# Altium schematic sheet NAVCPeripherals.SchDoc
size 297 x 209 mm
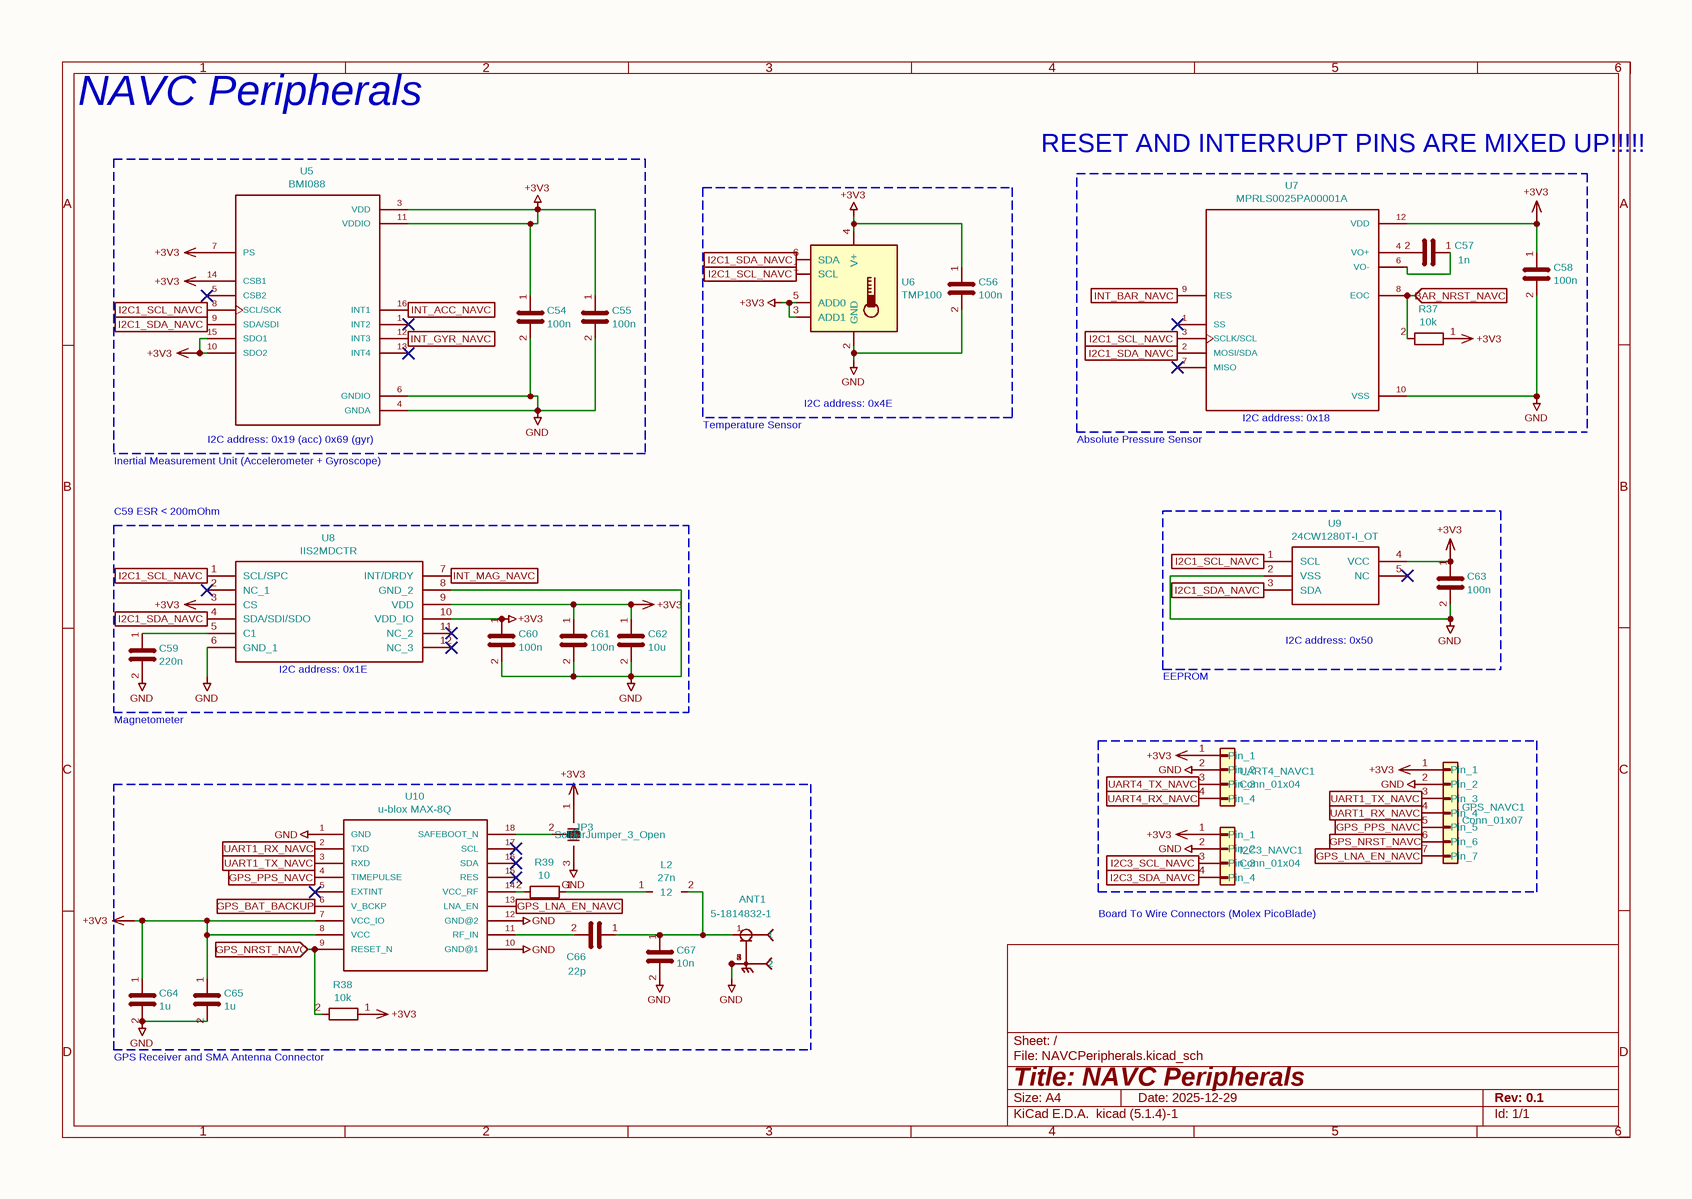
[diagram p0: NAVCPeripherals.SchDoc]

## Parts
ANT1  5-1814832-1  [TE_5-1814832-1]
C54  100n  [C_0402_1005Metric]
C55  100n  [C_0402_1005Metric]
C56  100n  [C_0402_1005Metric]
C57  1n  [C_0402_1005Metric]
C58  100n  [C_0402_1005Metric]
C59  220n  [C_0603_1608Metric]
C60  100n  [C_0402_1005Metric]
C61  100n  [C_0402_1005Metric]
C62  10u  [C_0603_1608Metric]
C63  100n  [C_0402_1005Metric]
C64  1u  [C_0603_1608Metric]
C65  1u  [C_0603_1608Metric]
C66  22p  [C_0402_1005Metric]
C67  10n  [C_0402_1005Metric]
GPS_NAVC1  Conn_01x07  [Molex_PicoBlade_53048-0710_1x07_P1.25mm_Horizontal]
I2C3_NAVC1  Conn_01x04  [Molex_PicoBlade_53048-0410_1x04_P1.25mm_Horizontal]
JP3  SolderJumper_3_Open  [SolderJumper-3_P1.3mm_Open_RoundedPad1.0x1.5mm]
L2  27n  [L_0402_1005Metric]
R37  10k  [R_0402_1005Metric]
R38  10k  [R_0402_1005Metric]
R39  10  [R_0402_1005Metric]
U5  BMI088  [PQFN50P450X300X100-16N]
U6  TMP100  [SOT-23-6]
U7  MPRLS0025PA00001A  [XDCR_MPRLS0025PA00001A]
U8  IIS2MDCTR  [IIS2MDCTR]
U9  24CW1280T-I_OT  [SOT95P280X145-5N]
U10  u-blox MAX-8Q  [GPS18P-SMD-1.1-10X9.6MM]
UART4_NAVC1  Conn_01x04  [Molex_PicoBlade_53048-0410_1x04_P1.25mm_Horizontal]

## Blocks framed on the sheet
I2C address: 0x19 (acc) 0x69 (gyr): C54 C55 U5
I2C address: 0x4E: C56 U6
I2C address: 0x18: C57 C58 R37 U7
I2C address: 0x50: C63 U9

## Ports
BAR_NRST_NAVC (in), GPS_BAT_BACKUP (in), GPS_LNA_EN_NAVC (in), GPS_NRST_NAVC (in), GPS_PPS_NAVC (in), I2C1_SCL_NAVC (in), I2C1_SDA_NAVC (in), I2C3_SCL_NAVC (in), I2C3_SDA_NAVC (in), INT_ACC_NAVC (in), INT_BAR_NAVC (in), INT_GYR_NAVC (in), INT_MAG_NAVC (in), UART1_RX_NAVC (in), UART1_TX_NAVC (in), UART4_RX_NAVC (in), UART4_TX_NAVC (in)

## Nets
+3V3: C54.1 C55.1 C56.1 C58.1 C60.1 C61.1 C62.1 C63.1 C64.1 C65.1 GPS_NAVC1.1(Pin_1) I2C3_NAVC1.1(Pin_1) JP3.1(A) R37.1 R38.1 U5.3(VDD) U5.7(PS) U5.10(SDO2) U5.11(VDDIO) U5.14(CSB1) U5.15(SDO1) U6.3(ADD1) U6.4(V+) U6.5(ADD0) U7.12(VDD) U8.3(CS) U8.9(VDD) U8.10(VDD_IO) U9.4(VCC) U10.7(VCC_IO) U10.8(VCC) UART4_NAVC1.1(Pin_1)
GND: ANT1.2 ANT1.3(2) ANT1.4(2) ANT1.5(2) C54.2 C55.2 C56.2 C58.2 C59.2 C60.2 C61.2 C62.2 C63.2 C64.2 C65.2 C67.2 GPS_NAVC1.2(Pin_2) I2C3_NAVC1.2(Pin_2) JP3.3(B) U5.4(GNDA) U5.6(GNDIO) U6.2(GND) U7.10(VSS) U8.6(GND_1) U8.8(GND_2) U9.2(VSS) U10.1(GND) U10.10(GND@1) U10.12(GND@2) UART4_NAVC1.2(Pin_2)
BAR_NRST_NAVC: R37.2 U7.8(EOC) ; port BAR_NRST_NAVC
GPS_BAT_BACKUP: U10.6(V_BCKP) ; port GPS_BAT_BACKUP
GPS_LNA_EN_NAVC: GPS_NAVC1.7(Pin_7) U10.13(LNA_EN) ; port GPS_LNA_EN_NAVC
GPS_NRST_NAVC: GPS_NAVC1.6(Pin_6) R38.2 U10.9(RESET_N) ; port GPS_NRST_NAVC
GPS_PPS_NAVC: GPS_NAVC1.5(Pin_5) U10.4(TIMEPULSE) ; port GPS_PPS_NAVC
I2C1_SCL_NAVC: U5.8(SCL/SCK) U6.1(SCL) U7.3(SCLK/SCL) U8.1(SCL/SPC) U9.1(SCL) ; port I2C1_SCL_NAVC
I2C1_SDA_NAVC: U5.9(SDA/SDI) U6.6(SDA) U7.2(MOSI/SDA) U8.4(SDA/SDI/SDO) U9.3(SDA) ; port I2C1_SDA_NAVC
I2C3_SCL_NAVC: I2C3_NAVC1.3(Pin_3) ; port I2C3_SCL_NAVC
I2C3_SDA_NAVC: I2C3_NAVC1.4(Pin_4) ; port I2C3_SDA_NAVC
INT_ACC_NAVC: U5.16(INT1) ; port INT_ACC_NAVC
INT_BAR_NAVC: U7.9(RES) ; port INT_BAR_NAVC
INT_GYR_NAVC: U5.12(INT3) ; port INT_GYR_NAVC
INT_MAG_NAVC: U8.7(INT/DRDY) ; port INT_MAG_NAVC
UART1_RX_NAVC: GPS_NAVC1.4(Pin_4) U10.2(TXD) ; port UART1_RX_NAVC
UART1_TX_NAVC: GPS_NAVC1.3(Pin_3) U10.3(RXD) ; port UART1_TX_NAVC
UART4_RX_NAVC: UART4_NAVC1.4(Pin_4) ; port UART4_RX_NAVC
UART4_TX_NAVC: UART4_NAVC1.3(Pin_3) ; port UART4_TX_NAVC
NetANT1_1: ANT1.1 C66.1 C67.1 L2.2
NetC57_1: C57.1 U7.6(VO-)
NetC57_2: C57.2 U7.4(VO+)
NetC59_1: C59.1 U8.5(C1)
NetC66_2: C66.2 U10.11(RF_IN)
NetJP3_2: JP3.2(C) U10.18(SAFEBOOT_N)
NetL2_1: L2.1 R39.1
NetR39_2: R39.2 U10.14(VCC_RF)

Not connected (* = marked no-connect by the designer): U5 1(INT2)* 5(CSB2)* 13(INT4)*; U7 1(SS)* 7(MISO)*; U8 2(NC_1)* 11(NC_2)* 12(NC_3)*; U9 5(NC)*; U10 5(EXTINT)* 15(RES)* 16(SDA)* 17(SCL)*

## Notes on the sheet
- NAVC Peripherals
- RESET AND INTERRUPT PINS ARE MIXED UP!!!!!
- Temperature Sensor
- (near U5) Inertial Measurement Unit (Accelerometer + Gyroscope)
- (near U7) Absolute Pressure Sensor
- C59 ESR < 200mOhm
- (near U8) I2C address: 0x1E
- EEPROM
- (near C59) Magnetometer
- (near I2C3_NAVC1) Board To Wire Connectors
  (Molex PicoBlade)
- GPS Receiver and SMA Antenna Connector
- 1
- 2
- 3
- 4
- 5
- 6
- A
- B
- C
- D
- Title: NAVC Peripherals
- File: NAVCPeripherals.kicad_sch
- Sheet: /
- KiCad E.D.A.  kicad (5.1.4)-1
- Size: A4
- Date: 2025-12-29
- Rev: 0.1
- Id: 1/1

## Library data of the parts
ANT1 = 5-1814832-1_2: Field4: TE Connectivity; Field5: SMA/QMA socket 50 Ohm | TE Connectivity 518148321 _SMA/QMA socket 50 Ohm RF Connectors_.; Field6: 518148321; Field7: None; Field8: Unavailable; Field9: None; Value: 5-1814832-1; Footprint: 5-1814832-1:TE_5-1814832-1
C54-C67 = C
  C54-C56 C58 C60 C61 C63: Value: 100n; Footprint: Capacitor_SMD:C_0402_1005Metric
  C57: Value: 1n; Footprint: Capacitor_SMD:C_0402_1005Metric
  C59: Value: 220n; Footprint: Capacitor_SMD:C_0603_1608Metric
  C62: Value: 10u; Footprint: Capacitor_SMD:C_0603_1608Metric
  C64 C65: Value: 1u; Footprint: Capacitor_SMD:C_0603_1608Metric
  C66: Value: 22p; Footprint: Capacitor_SMD:C_0402_1005Metric
  C67: Value: 10n; Footprint: Capacitor_SMD:C_0402_1005Metric
JP3 = SolderJumper_3_Open-Jumper: Value: SolderJumper_3_Open; Footprint: Jumper:SolderJumper-3_P1.3mm_Open_RoundedPad1.0x1.5mm
L2 = L: Value: 27n; Footprint: Inductor_SMD:L_0402_1005Metric; Supplier 1: DigiKey; Supplier Part Number 1: LQW04AN27NJ00D-ND
R37-R39 = R: Footprint: Resistor_SMD:R_0402_1005Metric
  R37 R38: Value: 10k
  R39: Value: 10
U5 = BMI088_2: Field4: None; Field5: VFLGA-16 Bosch Sensortec; Field6: Bosch Sensortec; Field7: High-performance 6-axis inertial sensor _accelerometer + gyroscope_; Field8: Unavailable; Value: BMI088; Footprint: BMI088:PQFN50P450X300X100-16N
U7 = MPRLS0025PA00001A_2: Field4: Unavailable; Field5: Pressure Sensor 0psi to 25psi Absolute 12-Pin T/R; Field6: SMD-10 Honeywell; Field7: Honeywell Sensing; Field8: None; Value: MPRLS0025PA00001A; Footprint: MPRLS0025PA00001A:XDCR_MPRLS0025PA00001A
U8 = IIS2MDCTR: Manufacturer_Name: STMicroelectronics; Height: 0.7; Manufacturer_Part_Number: IIS2MDCTR; Mouser Part Number: 511-IIS2MDCTR; Mouser Price/Stock: https://www.mouser.com/Search/Refine.aspx?Keyword=511-IIS2MDCTR; Value: IIS2MDCTR; Footprint: IIS2MDCTR:IIS2MDCTR
U9 = 24CW1280T-I_OT: Manufacturer_Name: Microchip; Manufacturer_Part_Number: 24CW1280T-I/OT; Height: 1.45; Mouser Part Number: 579-24CW1280T-I/OT; Mouser Price/Stock: https://www.mouser.com/Search/Refine.aspx?Keyword=579-24CW1280T-I%2FOT; RS Part Number: 1871851; RS Price/Stock: http://uk.rs-online.com/web/p/products/1871851; Value: 24CW1280T-I_OT; Footprint: 24CW1280T-I_OT:SOT95P280X145-5N
U10 = MODULE-GPS-SMD-MAX-7Q-0(18P-9.6X10MM)_2: Field4: SMD-18 u-blox; Field5: SMD GPS Module;; Field6: Unavailable; Field8: None; Field7: MAX-7Q-0; Value: u-blox MAX-8Q; Footprint: MODULE-GPS-SMD-MAX-7Q-0_18P-9.6X10MM_:GPS18P-SMD-1.1-10X9.6MM
GPS_NAVC1 = Conn_01x07: Value: Conn_01x07; Footprint: Connector_Molex:Molex_PicoBlade_53048-0710_1x07_P1.25mm_Horizontal
I2C3_NAVC1 UART4_NAVC1 = Conn_01x04: Value: Conn_01x04; Footprint: Connector_Molex:Molex_PicoBlade_53048-0410_1x04_P1.25mm_Horizontal
U6 = TMP100: Value: TMP100; Footprint: Package_TO_SOT_SMD:SOT-23-6